# EAGLE design display (EAGLE 5.10)
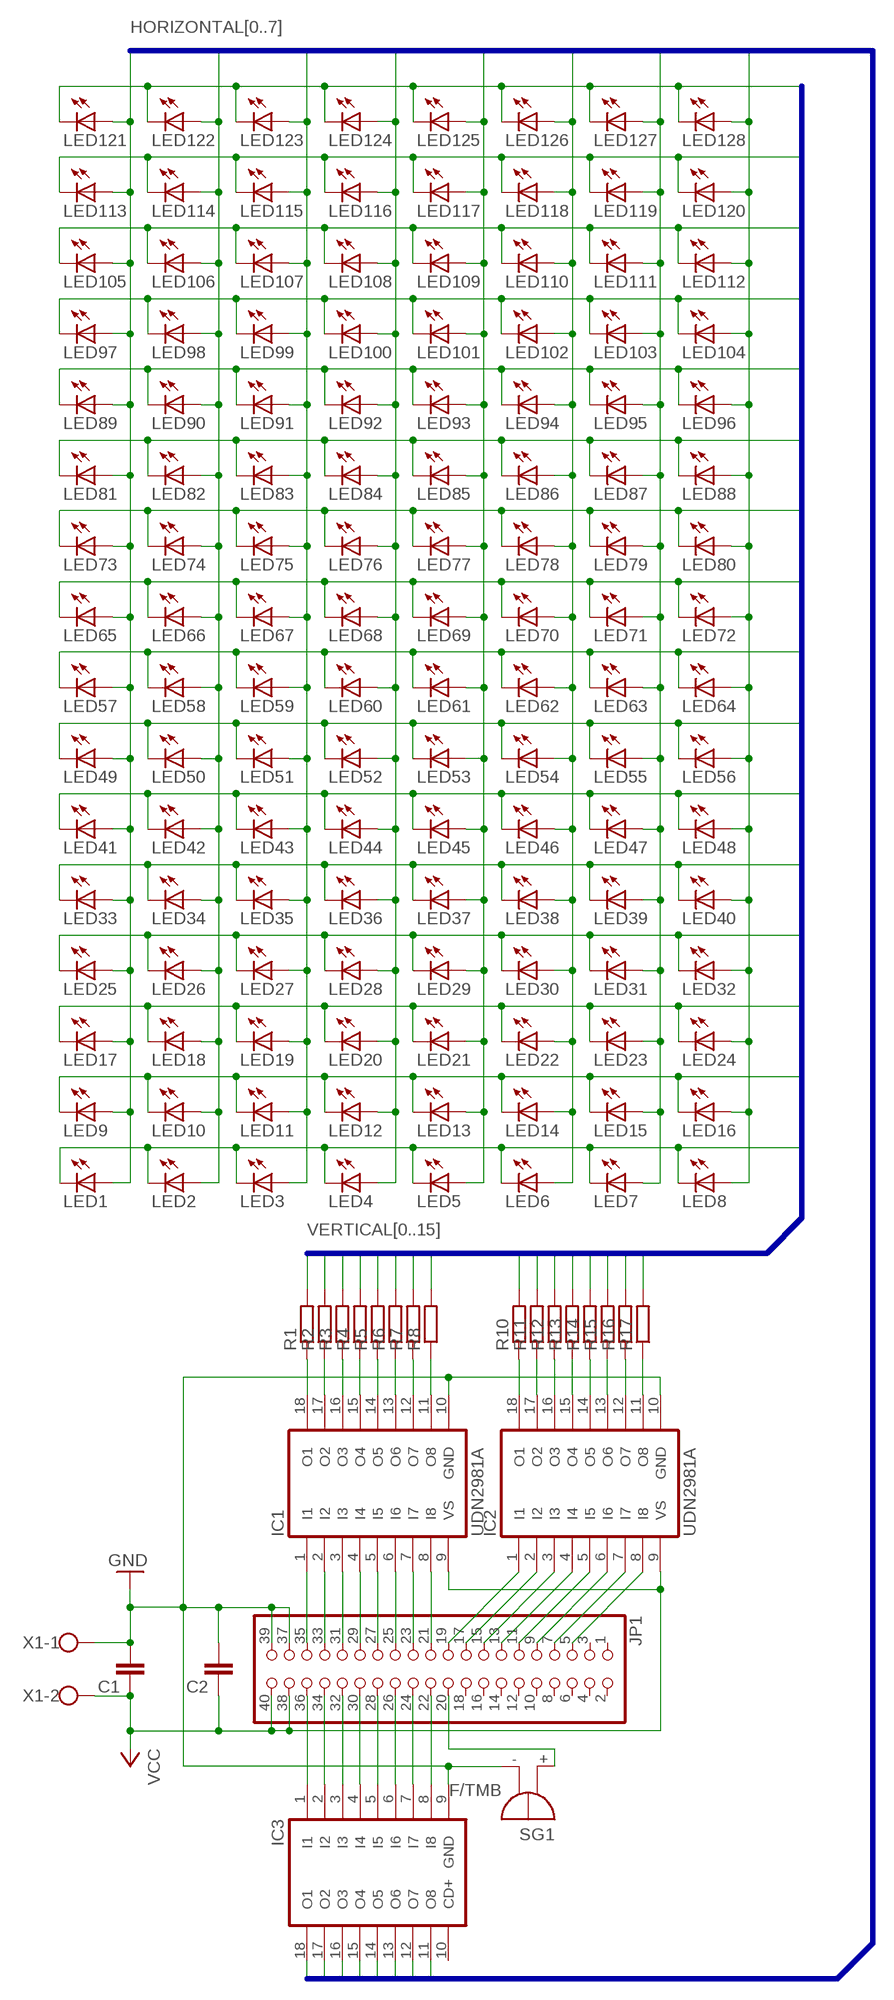
[diagram p0: schematic, sheet 1]

## Parts
C1  C-EU025-030X050  [C025-030X050]
C2  C-EU025-030X050  [C025-030X050]
IC1  UDN2981A  [DIL18]
IC2  UDN2981A  [DIL18]
IC3  ULN2803A  [DIL18]
JP1  PINHD-2X20  [2X20]
LED1  LED5MM  [LED5MM]
LED2  LED5MM  [LED5MM]
LED3  LED5MM  [LED5MM]
LED4  LED5MM  [LED5MM]
LED5  LED5MM  [LED5MM]
LED6  LED5MM  [LED5MM]
LED7  LED5MM  [LED5MM]
LED8  LED5MM  [LED5MM]
LED9  LED5MM  [LED5MM]
LED10  LED5MM  [LED5MM]
LED11  LED5MM  [LED5MM]
LED12  LED5MM  [LED5MM]
LED13  LED5MM  [LED5MM]
LED14  LED5MM  [LED5MM]
LED15  LED5MM  [LED5MM]
LED16  LED5MM  [LED5MM]
LED17  LED5MM  [LED5MM]
LED18  LED5MM  [LED5MM]
LED19  LED5MM  [LED5MM]
LED20  LED5MM  [LED5MM]
LED21  LED5MM  [LED5MM]
LED22  LED5MM  [LED5MM]
LED23  LED5MM  [LED5MM]
LED24  LED5MM  [LED5MM]
LED25  LED5MM  [LED5MM]
LED26  LED5MM  [LED5MM]
LED27  LED5MM  [LED5MM]
LED28  LED5MM  [LED5MM]
LED29  LED5MM  [LED5MM]
LED30  LED5MM  [LED5MM]
LED31  LED5MM  [LED5MM]
LED32  LED5MM  [LED5MM]
LED33  LED5MM  [LED5MM]
LED34  LED5MM  [LED5MM]
LED35  LED5MM  [LED5MM]
LED36  LED5MM  [LED5MM]
LED37  LED5MM  [LED5MM]
LED38  LED5MM  [LED5MM]
LED39  LED5MM  [LED5MM]
LED40  LED5MM  [LED5MM]
LED41  LED5MM  [LED5MM]
LED42  LED5MM  [LED5MM]
LED43  LED5MM  [LED5MM]
LED44  LED5MM  [LED5MM]
LED45  LED5MM  [LED5MM]
LED46  LED5MM  [LED5MM]
LED47  LED5MM  [LED5MM]
LED48  LED5MM  [LED5MM]
LED49  LED5MM  [LED5MM]
LED50  LED5MM  [LED5MM]
LED51  LED5MM  [LED5MM]
LED52  LED5MM  [LED5MM]
LED53  LED5MM  [LED5MM]
LED54  LED5MM  [LED5MM]
LED55  LED5MM  [LED5MM]
LED56  LED5MM  [LED5MM]
LED57  LED5MM  [LED5MM]
LED58  LED5MM  [LED5MM]
LED59  LED5MM  [LED5MM]
LED60  LED5MM  [LED5MM]
LED61  LED5MM  [LED5MM]
LED62  LED5MM  [LED5MM]
LED63  LED5MM  [LED5MM]
LED64  LED5MM  [LED5MM]
LED65  LED5MM  [LED5MM]
LED66  LED5MM  [LED5MM]
LED67  LED5MM  [LED5MM]
LED68  LED5MM  [LED5MM]
LED69  LED5MM  [LED5MM]
LED70  LED5MM  [LED5MM]
LED71  LED5MM  [LED5MM]
LED72  LED5MM  [LED5MM]
LED73  LED5MM  [LED5MM]
LED74  LED5MM  [LED5MM]
LED75  LED5MM  [LED5MM]
LED76  LED5MM  [LED5MM]
LED77  LED5MM  [LED5MM]
LED78  LED5MM  [LED5MM]
LED79  LED5MM  [LED5MM]
LED80  LED5MM  [LED5MM]
LED81  LED5MM  [LED5MM]
LED82  LED5MM  [LED5MM]
LED83  LED5MM  [LED5MM]
LED84  LED5MM  [LED5MM]
LED85  LED5MM  [LED5MM]
LED86  LED5MM  [LED5MM]
LED87  LED5MM  [LED5MM]
LED88  LED5MM  [LED5MM]
LED89  LED5MM  [LED5MM]
LED90  LED5MM  [LED5MM]
LED91  LED5MM  [LED5MM]
LED92  LED5MM  [LED5MM]
LED93  LED5MM  [LED5MM]
LED94  LED5MM  [LED5MM]
LED95  LED5MM  [LED5MM]
LED96  LED5MM  [LED5MM]
LED97  LED5MM  [LED5MM]
LED98  LED5MM  [LED5MM]
LED99  LED5MM  [LED5MM]
LED100  LED5MM  [LED5MM]
LED101  LED5MM  [LED5MM]
LED102  LED5MM  [LED5MM]
LED103  LED5MM  [LED5MM]
LED104  LED5MM  [LED5MM]
LED105  LED5MM  [LED5MM]
LED106  LED5MM  [LED5MM]
LED107  LED5MM  [LED5MM]
LED108  LED5MM  [LED5MM]
LED109  LED5MM  [LED5MM]
LED110  LED5MM  [LED5MM]
LED111  LED5MM  [LED5MM]
LED112  LED5MM  [LED5MM]
LED113  LED5MM  [LED5MM]
LED114  LED5MM  [LED5MM]
LED115  LED5MM  [LED5MM]
LED116  LED5MM  [LED5MM]
LED117  LED5MM  [LED5MM]
LED118  LED5MM  [LED5MM]
LED119  LED5MM  [LED5MM]
LED120  LED5MM  [LED5MM]
LED121  LED5MM  [LED5MM]
LED122  LED5MM  [LED5MM]
LED123  LED5MM  [LED5MM]
LED124  LED5MM  [LED5MM]
LED125  LED5MM  [LED5MM]
LED126  LED5MM  [LED5MM]
LED127  LED5MM  [LED5MM]
LED128  LED5MM  [LED5MM]
R1  R-EU_0204/2V  [0204V]
R2  R-EU_0204/2V  [0204V]
R3  R-EU_0204/2V  [0204V]
R4  R-EU_0204/2V  [0204V]
R5  R-EU_0204/2V  [0204V]
R6  R-EU_0204/2V  [0204V]
R7  R-EU_0204/2V  [0204V]
R8  R-EU_0204/2V  [0204V]
R10  R-EU_0204/2V  [0204V]
R11  R-EU_0204/2V  [0204V]
R12  R-EU_0204/2V  [0204V]
R13  R-EU_0204/2V  [0204V]
R14  R-EU_0204/2V  [0204V]
R15  R-EU_0204/2V  [0204V]
R16  R-EU_0204/2V  [0204V]
R17  R-EU_0204/2V  [0204V]
SG1  F/TMB  [F/TMB]
X1  W237-102  [W237-102]

## Nets
GND: C1.2 C2.2 IC1.10(GND) IC2.10(GND) IC3.9(GND) JP1.37 JP1.39 SG1.- X1.1
HORIZONTAL0: LED1.K(C) LED2.K(C) LED3.K(C) LED4.K(C) LED5.K(C) LED6.K(C) LED7.K(C) LED8.K(C) R17.2
HORIZONTAL1: LED9.K(C) LED10.K(C) LED11.K(C) LED12.K(C) LED13.K(C) LED14.K(C) LED15.K(C) LED16.K(C) R16.2
HORIZONTAL2: LED17.K(C) LED18.K(C) LED19.K(C) LED20.K(C) LED21.K(C) LED22.K(C) LED23.K(C) LED24.K(C) R15.2
HORIZONTAL3: LED25.K(C) LED26.K(C) LED27.K(C) LED28.K(C) LED29.K(C) LED30.K(C) LED31.K(C) LED32.K(C) R14.2
HORIZONTAL4: LED33.K(C) LED34.K(C) LED35.K(C) LED36.K(C) LED37.K(C) LED38.K(C) LED39.K(C) LED40.K(C) R13.2
HORIZONTAL5: LED41.K(C) LED42.K(C) LED43.K(C) LED44.K(C) LED45.K(C) LED46.K(C) LED47.K(C) LED48.K(C) R12.2
HORIZONTAL6: LED49.K(C) LED50.K(C) LED51.K(C) LED52.K(C) LED53.K(C) LED54.K(C) LED55.K(C) LED56.K(C) R11.2
HORIZONTAL7: LED57.K(C) LED58.K(C) LED59.K(C) LED60.K(C) LED61.K(C) LED62.K(C) LED63.K(C) LED64.K(C) R10.2
HORIZONTAL8: LED65.K(C) LED66.K(C) LED67.K(C) LED68.K(C) LED69.K(C) LED70.K(C) LED71.K(C) LED72.K(C) R8.2
HORIZONTAL9: LED73.K(C) LED74.K(C) LED75.K(C) LED76.K(C) LED77.K(C) LED78.K(C) LED79.K(C) LED80.K(C) R7.2
HORIZONTAL10: LED81.K(C) LED82.K(C) LED83.K(C) LED84.K(C) LED85.K(C) LED86.K(C) LED87.K(C) LED88.K(C) R6.2
HORIZONTAL11: LED89.K(C) LED90.K(C) LED91.K(C) LED92.K(C) LED93.K(C) LED94.K(C) LED95.K(C) LED96.K(C) R5.2
HORIZONTAL12: LED97.K(C) LED98.K(C) LED99.K(C) LED100.K(C) LED101.K(C) LED102.K(C) LED103.K(C) LED104.K(C) R4.2
HORIZONTAL13: LED105.K(C) LED106.K(C) LED107.K(C) LED108.K(C) LED109.K(C) LED110.K(C) LED111.K(C) LED112.K(C) R3.2
HORIZONTAL14: LED113.K(C) LED114.K(C) LED115.K(C) LED116.K(C) LED117.K(C) LED118.K(C) LED119.K(C) LED120.K(C) R2.2
HORIZONTAL15: LED121.K(C) LED122.K(C) LED123.K(C) LED124.K(C) LED125.K(C) LED126.K(C) LED127.K(C) LED128.K(C) R1.2
N$1: IC1.1(I1) JP1.35
N$2: IC1.2(I2) JP1.33
N$3: IC1.3(I3) JP1.31
N$4: IC1.4(I4) JP1.29
N$5: IC1.5(I5) JP1.27
N$6: IC1.6(I6) JP1.25
N$7: IC1.7(I7) JP1.23
N$8: IC1.8(I8) JP1.21
N$9: IC2.1(I1) JP1.19
N$10: IC2.2(I2) JP1.17
N$11: IC2.3(I3) JP1.15
N$12: IC2.4(I4) JP1.13
N$13: IC2.5(I5) JP1.11
N$14: IC2.6(I6) JP1.9
N$15: IC2.7(I7) JP1.7
N$16: IC2.8(I8) JP1.5
N$17: IC3.1(I1) JP1.36
N$18: IC3.2(I2) JP1.34
N$19: IC3.3(I3) JP1.32
N$20: IC3.4(I4) JP1.30
N$21: IC3.5(I5) JP1.28
N$22: IC3.6(I6) JP1.26
N$23: IC3.7(I7) JP1.24
N$24: IC3.8(I8) JP1.22
N$25: IC2.11(O8) R17.1
N$26: IC2.12(O7) R16.1
N$27: IC2.13(O6) R15.1
N$28: IC2.14(O5) R14.1
N$29: IC2.15(O4) R13.1
N$30: IC2.16(O3) R12.1
N$31: IC2.17(O2) R11.1
N$32: IC2.18(O1) R10.1
N$33: IC1.11(O8) R8.1
N$34: IC1.12(O7) R7.1
N$35: IC1.13(O6) R6.1
N$36: IC1.14(O5) R5.1
N$37: IC1.15(O4) R4.1
N$38: IC1.16(O3) R3.1
N$39: IC1.17(O2) R2.1
N$40: IC1.18(O1) R1.1
N$41: JP1.20 SG1.+
VCC: C1.1 C2.1 IC1.9(VS) IC2.9(VS) JP1.38 JP1.40 X1.2
VERTICAL0: IC3.18(O1) LED1.A LED9.A LED17.A LED25.A LED33.A LED41.A LED49.A LED57.A LED65.A LED73.A LED81.A LED89.A LED97.A LED105.A LED113.A LED121.A
VERTICAL1: IC3.17(O2) LED2.A LED10.A LED18.A LED26.A LED34.A LED42.A LED50.A LED58.A LED66.A LED74.A LED82.A LED90.A LED98.A LED106.A LED114.A LED122.A
VERTICAL2: IC3.16(O3) LED3.A LED11.A LED19.A LED27.A LED35.A LED43.A LED51.A LED59.A LED67.A LED75.A LED83.A LED91.A LED99.A LED107.A LED115.A LED123.A
VERTICAL3: IC3.15(O4) LED4.A LED12.A LED20.A LED28.A LED36.A LED44.A LED52.A LED60.A LED68.A LED76.A LED84.A LED92.A LED100.A LED108.A LED116.A LED124.A
VERTICAL4: IC3.14(O5) LED5.A LED13.A LED21.A LED29.A LED37.A LED45.A LED53.A LED61.A LED69.A LED77.A LED85.A LED93.A LED101.A LED109.A LED117.A LED125.A
VERTICAL5: IC3.13(O6) LED6.A LED14.A LED22.A LED30.A LED38.A LED46.A LED54.A LED62.A LED70.A LED78.A LED86.A LED94.A LED102.A LED110.A LED118.A LED126.A
VERTICAL6: IC3.12(O7) LED7.A LED15.A LED23.A LED31.A LED39.A LED47.A LED55.A LED63.A LED71.A LED79.A LED87.A LED95.A LED103.A LED111.A LED119.A LED127.A
VERTICAL7: IC3.11(O8) LED8.A LED16.A LED24.A LED32.A LED40.A LED48.A LED56.A LED64.A LED72.A LED80.A LED88.A LED96.A LED104.A LED112.A LED120.A LED128.A
Unconnected: IC3.10(CD+) JP1.1 JP1.2 JP1.3 JP1.4 JP1.6 JP1.8 JP1.10 JP1.12 JP1.14 JP1.16 JP1.18

## Buses
HORIZONTAL[0..7]
VERTICAL[0..15]

## Library data of the parts
C1 C2 = rcl:C-EU: CAPACITOR, European symbol
IC1 IC2 = uln-udn:UDN298*: DRIVER ARRAY Source: Allegro Microsystems Inc. / UDN2981-UDN2984.pdf
IC3 = uln-udn:ULN2803A: DRIVER ARRAY
JP1 = pinhead:PINHD-2X20: PIN HEADER
LED1-LED128 = led:LED: LED OSRAM: - CHIPLED LG R971, LG N971, LY N971, LG Q971, LY Q971, LO R971, LY R971 LH N974, LH R974 LS Q976, LO Q976, LY Q976 LO Q996 - Hyper CHIPLED LW Q18S LB Q993, LB Q99A, LB R99A - SideLED LS A670, LO A670, LY A670, LG A670, LP A670 LB A673, LV A673, LT A673, LW A673 LH A674 LY A675 LS A676, LA A676, LO A676, LY A676, LW A676 LS A679, LY A679, LG A679 - Hyper Micro SIDELED® LS Y876, LA Y876, LO Y876, LY Y876 LT Y87S - SmartLED LW L88C, LW L88S LB L89C, LB L89S, LG L890 LS L89K, LO L89K, LY L89K LS L896, LA L896, LO L896, LY L896 - TOPLED LS T670, LO T670, LY T670, LG T670, LP T670 LSG T670, LSP T670, LSY T670, LOP T670, LYG T670 LG T671, LOG T671, LSG T671 LB T673, LV T673, LT T673, LW T673 LH T674 LS T676, LA T676, LO T676, LY T676, LB T676, LH T676, LSB T676, LW T676 LB T67C, LV T67C, LT T67C, LS T67K, LO T67K, LY T67K, LW E67C LS E67B, LA E67B, LO E67B, LY E67B, LB E67C, LV E67C, LT E67C LW T67C LS T679, LY T679, LG T679 LS T770, LO T770, LY T770, LG T770, LP T770 LB T773, LV T773, LT T773, LW T773 LH T774 LS E675, LA E675, LY E675, LS T675 LS T776, LA T776, LO T776, LY T776, LB T776 LHGB T686 LT T68C, LB T68C - Hyper Mini TOPLED® LB M676 - Mini TOPLED Santana® LG M470 LS M47K, LO M47K, LY M47K Source: http://www.osram.convergy.de LUXEON: - LUMILED® LXK2-PW12-R00, LXK2-PW12-S00, LXK2-PW14-U00, LXK2-PW14-V00 LXK2-PM12-R00, LXK2-PM12-S00, LXK2-PM14-U00 LXK2-PE12-Q00, LXK2-PE12-R00, LXK2-PE12-S00, LXK2-PE14-T00, LXK2-PE14-U00 LXK2-PB12-K00, LXK2-PB12-L00, LXK2-PB12-M00, LXK2-PB14-N00, LXK2-PB14-P00, LXK2-PB14-Q00 LXK2-PR12-L00, LXK2-PR12-M00, LXK2-PR14-Q00, LXK2-PR14-R00 LXK2-PD12-Q00, LXK2-PD12-R00, LXK2-PD12-S00 LXK2-PH12-R00, LXK2-PH12-S00 LXK2-PL12-P00, LXK2-PL12-Q00, LXK2-PL12-R00 Source: www.luxeon.com KINGBRIGHT: KA-3528ASYC Source: www.kingbright.com
R1-R8 R10-R17 = rcl:R-EU_: RESISTOR, European symbol
SG1 = buzzer:F/TMB: BUZZER Source: Buerklin
X1 = con-wago-500:W237-102: WAGO SCREW CLAMP

## Board
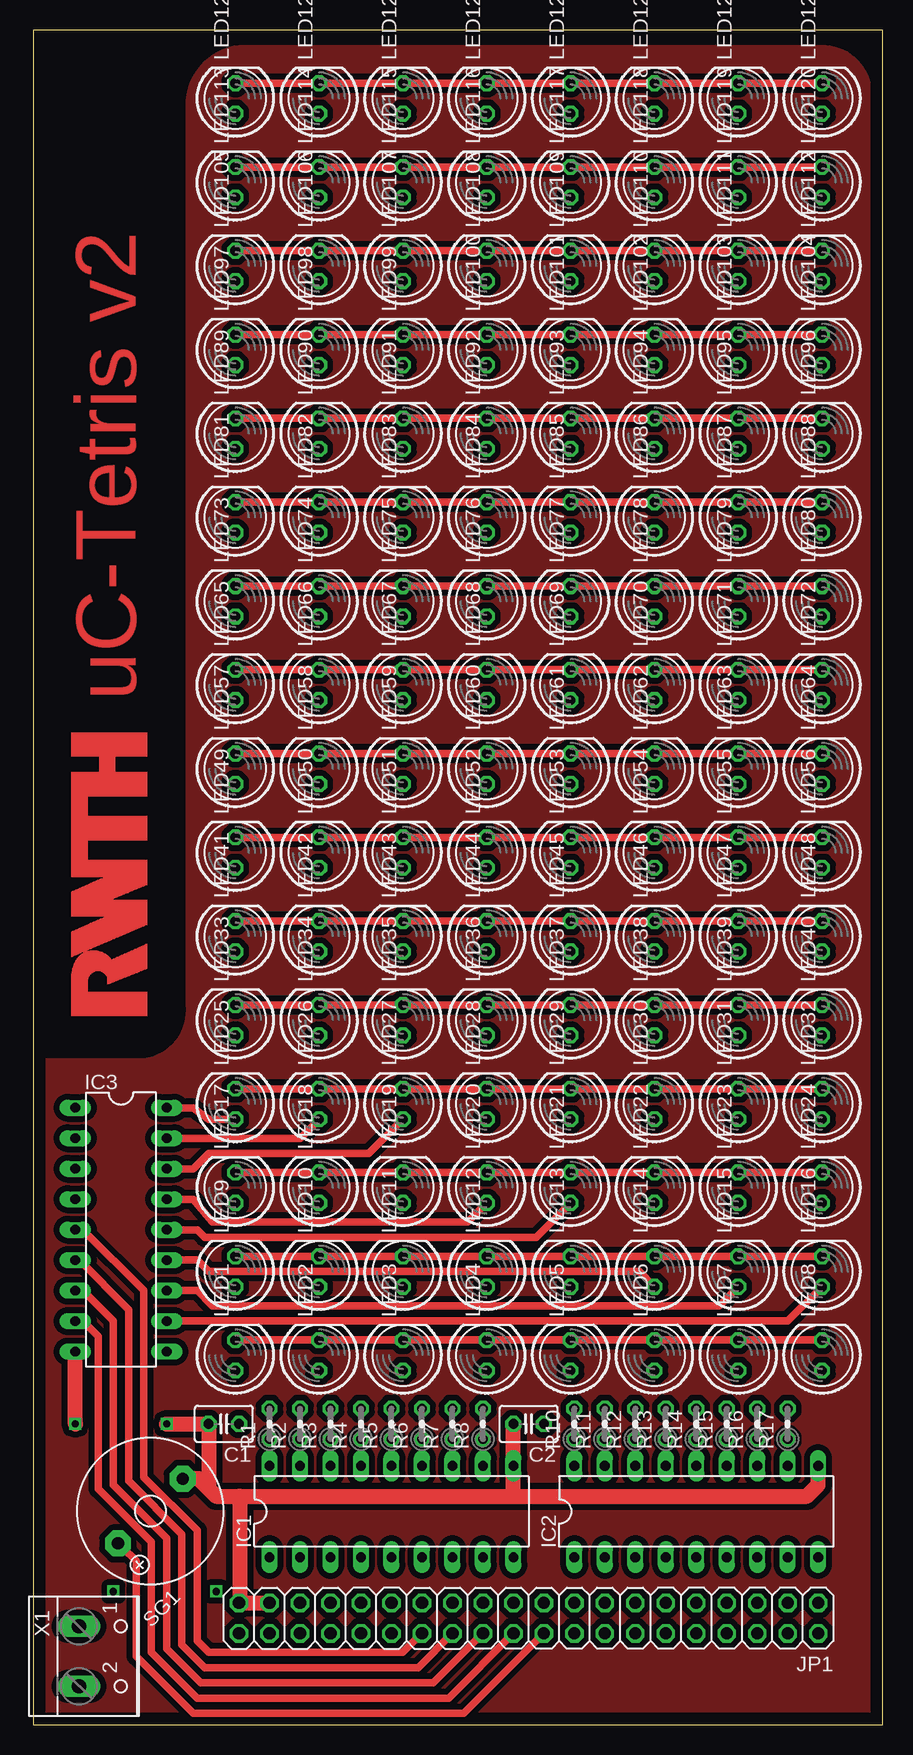
[diagram p1: board, top side]
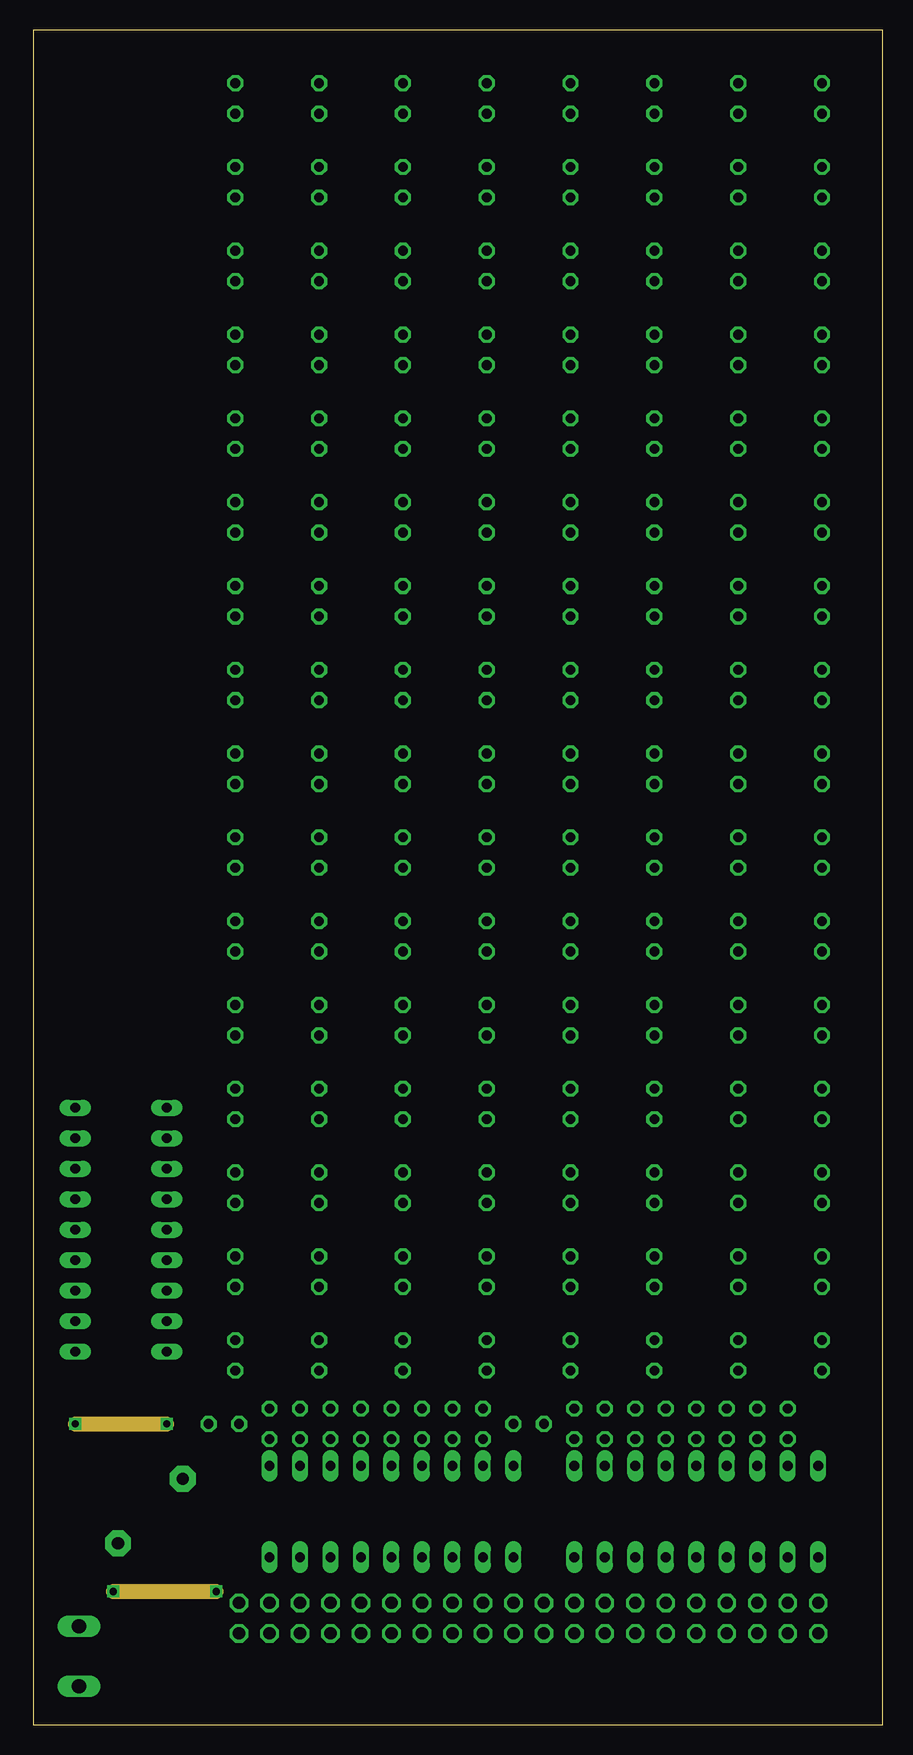
[diagram p2: board, inner layer Wires]
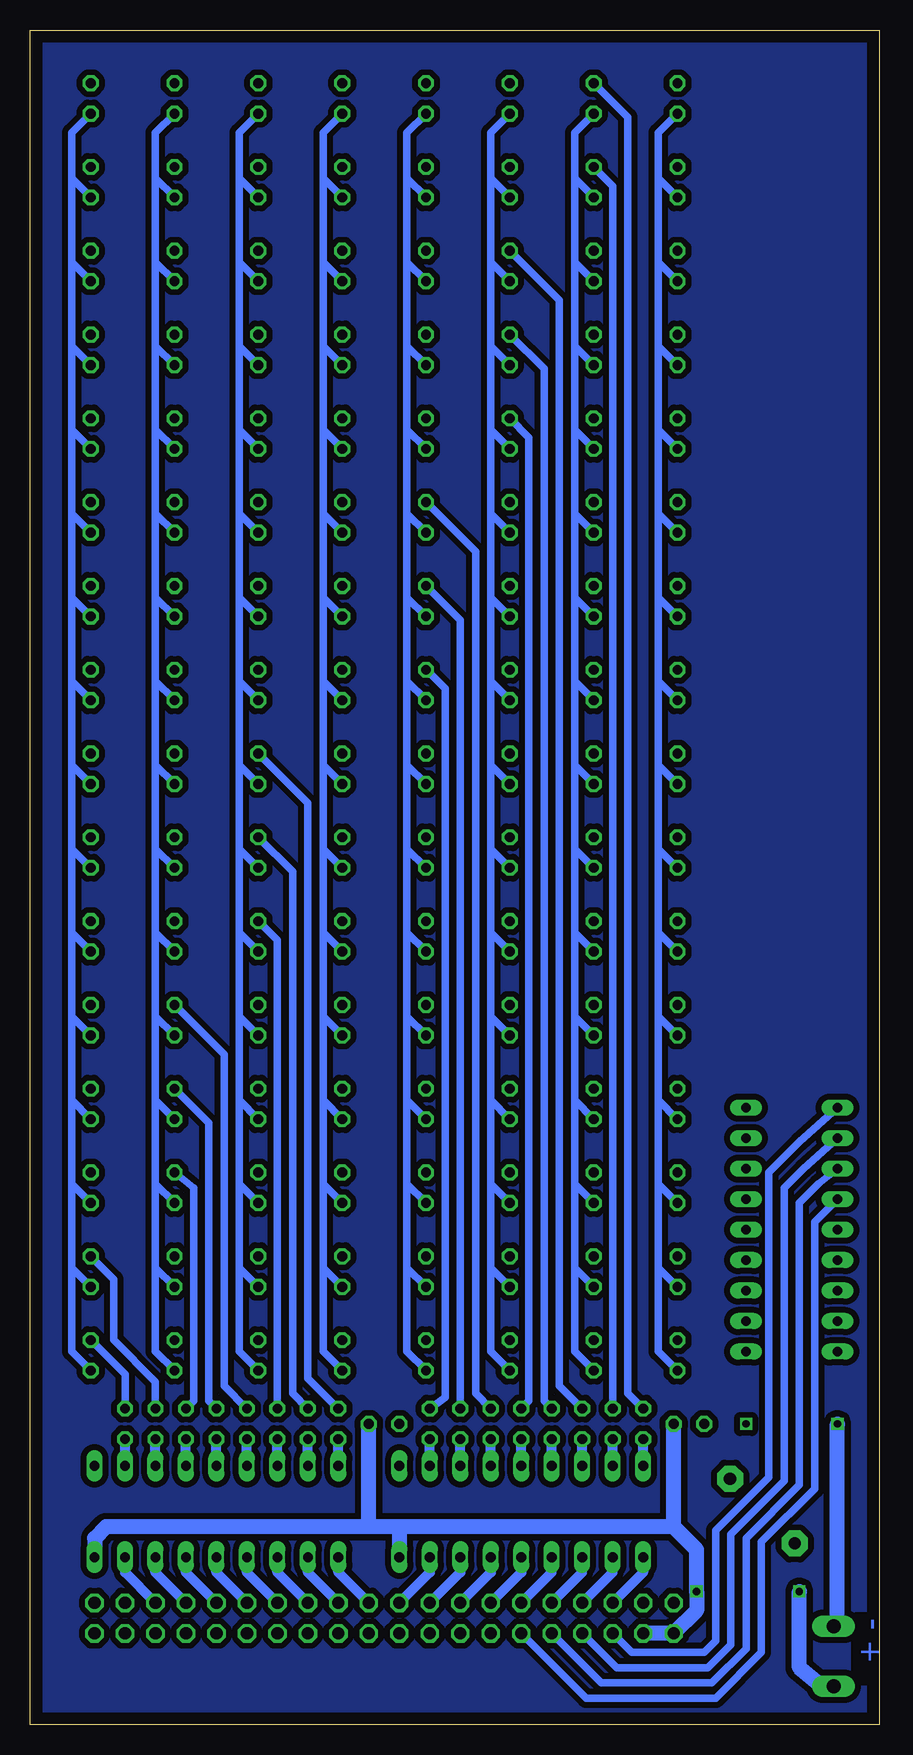
[diagram p3: board, bottom side, seen from below]

Size 70.78 x 141.28 mm. Coordinates in mm from the lower left corner, seen from the top.
Outline: 0,0 70.78,0 70.78,141.28 0,141.28 0,0
Copper layers (1*2*16): Top 0.035mm / dielectric 1.5mm / Wires 0.035mm / dielectric 0.15mm / Bottom 0.035mm
Design rules "default *": minimum track width 10mil, minimum drill 24mil, track to track 20mil, track to pad 20mil, pad to pad 8mil, via to via 8mil, smd to smd 8mil, copper to edge 40mil, drill to drill 8mil, minimum pad ring 10mil, minimum via ring 8mil, stop-mask expansion 4mil, vias tented up to drill 0mil, thermal gap 10mil

### Footprints (pad centres in the part's own frame; a part is rotated, then mirrored left to right if it is on the bottom)
C025-030X050 = drill 0.813 octagon: 1 -1.27,0; 2 1.27,0
DIL18 = drill 0.813 long: 1 -10.16,-3.81; 2 -7.62,-3.81; 3 -5.08,-3.81; 4 -2.54,-3.81; 5 0,-3.81; 6 2.54,-3.81; 7 5.08,-3.81; 8 7.62,-3.81; 9 10.16,-3.81; 10 10.16,3.81; 11 7.62,3.81; 12 5.08,3.81; 13 2.54,3.81; 14 0,3.81; 15 -2.54,3.81; 16 -5.08,3.81; 17 -7.62,3.81; 18 -10.16,3.81
2X20 = drill 1.016 octagon: 1 -24.13,-1.27; 2 -24.13,1.27; 3 -21.59,-1.27; 4 -21.59,1.27; 5 -19.05,-1.27; 6 -19.05,1.27; 7 -16.51,-1.27; 8 -16.51,1.27; 9 -13.97,-1.27; 10 -13.97,1.27; 11 -11.43,-1.27; 12 -11.43,1.27; 13 -8.89,-1.27; 14 -8.89,1.27; 15 -6.35,-1.27; 16 -6.35,1.27; 17 -3.81,-1.27; 18 -3.81,1.27; 19 -1.27,-1.27; 20 -1.27,1.27; 21 1.27,-1.27; 22 1.27,1.27; 23 3.81,-1.27; 24 3.81,1.27; 25 6.35,-1.27; 26 6.35,1.27; 27 8.89,-1.27; 28 8.89,1.27; 29 11.43,-1.27; 30 11.43,1.27; 31 13.97,-1.27; 32 13.97,1.27; 33 16.51,-1.27; 34 16.51,1.27; 35 19.05,-1.27; 36 19.05,1.27; 37 21.59,-1.27; 38 21.59,1.27; 39 24.13,-1.27; 40 24.13,1.27
LED5MM = drill 0.813 octagon: A -1.27,0; K 1.27,0
0204V = drill 0.813 octagon: 1 -1.27,0; 2 1.27,0
F/TMB = drill 1.016 pad 2.159 octagon: + 3.81,0; - -3.81,0
W237-102 = drill 1.194 long: 1 -2.5,-1.27; 2 2.5,-1.27

### Placement (x,y rotation side)
C1  15.88,25.08 180 top
C2  41.27,25.08 180 top
IC1  29.84,17.78 0 top
IC2  55.24,17.78 0 top
IC3  7.3,41.27 270 top
JP1  41.27,8.89 180 top
LED1  16.83,30.8 90 top
LED2  23.81,30.8 90 top
LED3  30.8,30.8 90 top
LED4  37.78,30.8 90 top
LED5  44.77,30.8 90 top
LED6  51.75,30.8 90 top
LED7  58.74,30.8 90 top
LED8  65.72,30.8 90 top
LED9  16.83,37.78 90 top
LED10  23.81,37.78 90 top
LED11  30.8,37.78 90 top
LED12  37.78,37.78 90 top
LED13  44.77,37.78 90 top
LED14  51.75,37.78 90 top
LED15  58.74,37.78 90 top
LED16  65.72,37.78 90 top
LED17  16.83,44.77 90 top
LED18  23.81,44.77 90 top
LED19  30.8,44.77 90 top
LED20  37.78,44.77 90 top
LED21  44.77,44.77 90 top
LED22  51.75,44.77 90 top
LED23  58.74,44.77 90 top
LED24  65.72,44.77 90 top
LED25  16.83,51.75 90 top
LED26  23.81,51.75 90 top
LED27  30.8,51.75 90 top
LED28  37.78,51.75 90 top
LED29  44.77,51.75 90 top
LED30  51.75,51.75 90 top
LED31  58.74,51.75 90 top
LED32  65.72,51.75 90 top
LED33  16.83,58.74 90 top
LED34  23.81,58.74 90 top
LED35  30.8,58.74 90 top
LED36  37.78,58.74 90 top
LED37  44.77,58.74 90 top
LED38  51.75,58.74 90 top
LED39  58.74,58.74 90 top
LED40  65.72,58.74 90 top
LED41  16.83,65.72 90 top
LED42  23.81,65.72 90 top
LED43  30.8,65.72 90 top
LED44  37.78,65.72 90 top
LED45  44.77,65.72 90 top
LED46  51.75,65.72 90 top
LED47  58.74,65.72 90 top
LED48  65.72,65.72 90 top
LED49  16.83,72.71 90 top
LED50  23.81,72.71 90 top
LED51  30.8,72.71 90 top
LED52  37.78,72.71 90 top
LED53  44.77,72.71 90 top
LED54  51.75,72.71 90 top
LED55  58.74,72.71 90 top
LED56  65.72,72.71 90 top
LED57  16.83,79.69 90 top
LED58  23.81,79.69 90 top
LED59  30.8,79.69 90 top
LED60  37.78,79.69 90 top
LED61  44.77,79.69 90 top
LED62  51.75,79.69 90 top
LED63  58.74,79.69 90 top
LED64  65.72,79.69 90 top
LED65  16.83,86.68 90 top
LED66  23.81,86.68 90 top
LED67  30.8,86.68 90 top
LED68  37.78,86.68 90 top
LED69  44.77,86.68 90 top
LED70  51.75,86.68 90 top
LED71  58.74,86.68 90 top
LED72  65.72,86.68 90 top
LED73  16.83,93.66 90 top
LED74  23.81,93.66 90 top
LED75  30.8,93.66 90 top
LED76  37.78,93.66 90 top
LED77  44.77,93.66 90 top
LED78  51.75,93.66 90 top
LED79  58.74,93.66 90 top
LED80  65.72,93.66 90 top
LED81  16.83,100.65 90 top
LED82  23.81,100.65 90 top
LED83  30.8,100.65 90 top
LED84  37.78,100.65 90 top
LED85  44.77,100.65 90 top
LED86  51.75,100.65 90 top
LED87  58.74,100.65 90 top
LED88  65.72,100.65 90 top
LED89  16.83,107.63 90 top
LED90  23.81,107.63 90 top
LED91  30.8,107.63 90 top
LED92  37.78,107.63 90 top
LED93  44.77,107.63 90 top
LED94  51.75,107.63 90 top
LED95  58.74,107.63 90 top
LED96  65.72,107.63 90 top
LED97  16.83,114.62 90 top
LED98  23.81,114.62 90 top
LED99  30.8,114.62 90 top
LED100  37.78,114.62 90 top
LED101  44.77,114.62 90 top
LED102  51.75,114.62 90 top
LED103  58.74,114.62 90 top
LED104  65.72,114.62 90 top
LED105  16.83,121.6 90 top
LED106  23.81,121.6 90 top
LED107  30.8,121.6 90 top
LED108  37.78,121.6 90 top
LED109  44.77,121.6 90 top
LED110  51.75,121.6 90 top
LED111  58.74,121.6 90 top
LED112  65.72,121.6 90 top
LED113  16.83,128.59 90 top
LED114  23.81,128.59 90 top
LED115  30.8,128.59 90 top
LED116  37.78,128.59 90 top
LED117  44.77,128.59 90 top
LED118  51.75,128.59 90 top
LED119  58.74,128.59 90 top
LED120  65.72,128.59 90 top
LED121  16.83,135.57 90 top
LED122  23.81,135.57 90 top
LED123  30.8,135.57 90 top
LED124  37.78,135.57 90 top
LED125  44.77,135.57 90 top
LED126  51.75,135.57 90 top
LED127  58.74,135.57 90 top
LED128  65.72,135.57 90 top
R1  19.69,25.08 90 top
R2  22.23,25.08 90 top
R3  24.77,25.08 90 top
R4  27.31,25.08 90 top
R5  29.84,25.08 90 top
R6  32.39,25.08 90 top
R7  34.92,25.08 90 top
R8  37.46,25.08 90 top
R10  45.08,25.08 90 top
R11  47.63,25.08 90 top
R12  50.17,25.08 90 top
R13  52.7,25.08 90 top
R14  55.24,25.08 90 top
R15  57.79,25.08 90 top
R16  60.33,25.08 90 top
R17  62.86,25.08 90 top
SG1  9.75,17.82 225 top
X1  5.08,5.71 270 top

### Tracks (layer width: path | path; a pad name or v marks a point on that pad's centre or on a via)
GND  (via drill 0.6)
  Top 1.27: JP1.37 JP1.39 17.18,10.13 17.18,19.05 | IC2.10 65.41,20 64.45,19.05 40.01,19.05 | 40.01,19.05 IC1.10 C2.2 | v3.49,25.08 IC3.9 | 17.18,19.05 40.01,19.05 | v11.11,25.08 C1.2 14.61,19.69 | 17.18,19.05 15.24,19.05 14.61,19.69 | SG1.- 13.78,20.51 14.61,19.69
  Wires 1.27: v3.49,25.08 v11.11,25.08
  Bottom 1.27: v3.49,25.08 3.49,8.53 X1.1
HORIZONTAL0
  Top 0.61: LED1.K LED2.K LED3.K LED4.K LED5.K LED6.K LED7.K LED8.K
  Bottom 0.61: R17.2 62.86,29.21 LED8.K
HORIZONTAL1
  Top 0.61: LED9.K LED10.K LED11.K LED12.K LED13.K LED14.K LED15.K LED16.K
  Bottom 0.61: R16.2 60.33,28.57 63.82,32.07 63.82,37.15 LED16.K
HORIZONTAL2
  Top 0.61: LED24.K LED23.K LED22.K LED21.K LED20.K LED19.K LED18.K LED17.K
  Bottom 0.61: R15.2 57.15,26.99 57.15,44.77 LED23.K
HORIZONTAL3
  Top 0.61: LED25.K LED26.K LED27.K LED28.K LED29.K LED30.K LED31.K LED32.K
  Bottom 0.61: R14.2 55.88,26.99 55.88,50.17 LED31.K
HORIZONTAL4
  Top 0.61: LED33.K LED34.K LED35.K LED36.K LED37.K LED38.K LED39.K LED40.K
  Bottom 0.61: R13.2 54.61,28.26 54.61,55.88 LED39.K
HORIZONTAL5
  Top 0.61: LED48.K LED47.K LED46.K LED45.K LED44.K LED43.K LED42.K LED41.K
  Bottom 0.61: R12.2 50.17,65.4 LED46.K
HORIZONTAL6
  Top 0.61: LED49.K LED50.K LED51.K LED52.K LED53.K LED54.K LED55.K LED56.K
  Bottom 0.61: R11.2 48.89,27.62 48.89,71.12 LED54.K
HORIZONTAL7
  Top 0.61: LED64.K LED63.K LED62.K LED61.K LED60.K LED59.K LED58.K LED57.K
  Bottom 0.61: R10.2 47.63,28.89 47.63,76.84 LED62.K
HORIZONTAL8
  Top 0.61: LED65.K LED66.K LED67.K LED68.K LED69.K LED70.K LED71.K LED72.K
  Bottom 0.61: R8.2 36.2,27.3 36.2,86.36 LED68.K
HORIZONTAL9
  Top 0.61: LED73.K LED74.K LED75.K LED76.K LED77.K LED78.K LED79.K LED80.K
  Bottom 0.61: R7.2 34.92,92.07 LED76.K
HORIZONTAL10
  Top 0.61: LED81.K LED82.K LED83.K LED84.K LED85.K LED86.K LED87.K LED88.K
  Bottom 0.61: R6.2 33.65,27.62 33.65,97.79 LED84.K
HORIZONTAL11
  Top 0.61: LED96.K LED95.K LED94.K LED93.K LED92.K LED91.K LED90.K LED89.K
  Bottom 0.61: R5.2 29.21,26.99 29.21,107.31 LED91.K
HORIZONTAL12
  Top 0.61: LED97.K LED98.K LED99.K LED100.K LED101.K LED102.K LED103.K LED104.K
  Bottom 0.61: R4.2 27.94,26.99 27.94,113.03 LED99.K
HORIZONTAL13
  Top 0.61: LED112.K LED111.K LED110.K LED109.K LED108.K LED107.K LED106.K LED105.K
  Bottom 0.61: R3.2 26.67,28.26 26.67,118.74 LED107.K
HORIZONTAL14
  Top 0.61: LED113.K LED114.K LED115.K LED116.K LED117.K LED118.K LED119.K LED120.K
  Bottom 0.61: R2.2 22.23,128.27 LED114.K
HORIZONTAL15
  Top 0.61: LED121.K LED122.K LED123.K LED124.K LED125.K LED126.K LED127.K LED128.K
  Bottom 0.61: R1.2 20.95,27.62 20.95,133.99 LED122.K
N$1
  Bottom 0.813: IC1.1 19.69,12.7 JP1.35
N$2
  Bottom 0.813: IC1.2 22.23,12.7 JP1.33
N$3
  Bottom 0.813: IC1.3 24.76,12.7 JP1.31
N$4
  Bottom 0.813: IC1.4 27.31,12.7 JP1.29
N$5
  Bottom 0.813: IC1.5 29.84,12.7 JP1.27
N$6
  Bottom 0.813: IC1.6 32.39,12.7 JP1.25
N$7
  Bottom 0.813: IC1.7 34.92,12.7 JP1.23
N$8
  Bottom 0.813: IC1.8 37.46,12.7 JP1.21
N$9
  Bottom 0.813: IC2.1 45.08,12.7 JP1.19
N$10
  Bottom 0.813: IC2.2 47.63,12.7 JP1.17
N$11
  Bottom 0.813: IC2.3 50.17,12.7 JP1.15
N$12
  Bottom 0.813: IC2.4 52.7,12.7 JP1.13
N$13
  Bottom 0.813: IC2.5 55.24,12.7 JP1.11
N$14
  Bottom 0.813: IC2.6 57.79,12.7 JP1.9
N$15
  Bottom 0.813: IC2.7 60.33,12.7 JP1.7
N$16
  Bottom 0.813: IC2.8 62.86,12.7 JP1.5
N$17
  Bottom 0.61: IC3.1 6.67,48.58 9.21,46.04 9.21,20.64 13.65,16.19 13.65,6.99 14.61,6.03 20.64,6.03 JP1.36
N$18
  Bottom 0.61: IC3.2 6.35,46.35 7.94,44.77 7.94,20.32 12.38,15.87 12.38,6.67 14.29,4.76 21.91,4.76 JP1.34
N$19
  Bottom 0.61: IC3.3 5.08,45.09 6.67,43.5 6.67,20 11.11,15.56 11.11,6.35 13.97,3.49 23.18,3.49 JP1.32
N$20
  Bottom 0.61: IC3.4 5.4,41.91 5.4,19.69 9.84,15.24 9.84,6.03 13.65,2.22 24.45,2.22 JP1.30
N$21
  Top 0.61: JP1.28 30.8,6.03 14.61,6.03 13.65,6.99 13.65,16.19 9.21,20.64 9.21,36.2 4.13,41.28 IC3.5
N$22
  Top 0.61: JP1.26 32.07,4.76 14.29,4.76 12.38,6.67 12.38,15.87 7.94,20.32 7.94,34.61 3.81,38.74 IC3.6
N$23
  Top 0.61: JP1.24 33.34,3.49 13.97,3.49 11.11,6.35 11.11,15.56 6.67,20 6.67,33.65 4.13,36.2 IC3.7
N$24
  Top 0.61: JP1.22 34.61,2.22 13.65,2.22 9.84,6.03 9.84,15.24 5.4,19.69 5.4,32.39 4.13,33.65 IC3.8
N$25
  Bottom 0.813: IC2.11 R17.1
N$26
  Bottom 0.813: IC2.12 R16.1
N$27
  Bottom 0.813: IC2.13 R15.1
N$28
  Bottom 0.813: IC2.14 R14.1
N$29
  Bottom 0.813: IC2.15 R13.1
N$30
  Bottom 0.813: IC2.16 R12.1
N$31
  Bottom 0.813: IC2.17 R11.1
N$32
  Bottom 0.813: IC2.18 R10.1
N$33
  Bottom 0.813: IC1.11 R8.1
N$34
  Bottom 0.813: IC1.12 R7.1
N$35
  Bottom 0.813: IC1.13 R6.1
N$36
  Bottom 0.813: IC1.14 R5.1
N$37
  Bottom 0.813: IC1.15 R4.1
N$38
  Bottom 0.813: IC1.16 R3.1
N$39
  Bottom 0.813: IC1.17 R2.1
N$40
  Bottom 0.813: IC1.18 R1.1
N$41
  Top 0.61: SG1.+ 7.42,14.81 8.57,13.65 8.57,5.71 13.34,0.95 35.88,0.95 JP1.20
N$42
  pour Top: 0,55.56 9.21,55.56 arc90 12.7,60.01 12.7,134.94 arc-85 17.14,140.02 66.04,140.02 arc-90 69.85,135.57 69.85,0 0,0
N$44
  pour Bottom: 0,0 70.8,0 70.8,141.29 0,141.29
VCC  (via drill 0.6)
  Wires 1.27: v6.67,11.11 v15.24,11.11
  Bottom 1.27: JP1.38 JP1.40 15.24,9.52 v15.24,11.11 15.24,14.6 17.14,16.51 17.46,16.51 | IC2.9 65.41,15.56 64.45,16.51 42.55,16.51 | 40.01,16.51 IC1.9 | 40.01,16.51 42.55,16.51 | 17.46,16.51 40.01,16.51 | 42.55,16.51 C2.1 | C1.1 17.14,16.83 17.46,16.51 | v6.67,11.11 6.67,4.76 4.8,3.22 3.85,3.18 X1.2
VERTICAL0
  Top 0.61: LED25.A 14.61,50.48 13.34,51.43 IC3.18
  Bottom 0.61: LED1.A 18.42,31.12 18.42,38.1 | 18.42,38.1 18.42,45.09 | 18.42,45.09 18.42,52.07 | 18.42,52.07 18.42,59.06 | 18.42,59.06 18.42,66.04 | 18.42,66.04 18.42,73.03 | 18.42,73.03 18.42,80.01 | 18.42,80.01 18.42,86.99 | 18.42,86.99 18.42,93.98 | 18.42,93.98 18.42,100.96 | 18.42,100.96 18.42,107.95 | 18.42,107.95 18.42,114.93 | 18.42,114.93 18.42,121.92 | 18.42,121.92 18.42,128.9 | 18.42,128.9 18.42,132.71 LED121.A | 18.42,38.1 LED9.A | 18.42,45.09 LED17.A | 18.42,52.07 LED25.A | 18.42,59.06 LED33.A | 18.42,66.04 LED41.A | 18.42,73.03 LED49.A | 18.42,80.01 LED57.A | 18.42,86.99 LED65.A | 18.42,93.98 LED73.A | 18.42,100.96 LED81.A | 18.42,107.95 LED89.A | 18.42,114.93 LED97.A | 18.42,121.92 LED105.A | 18.42,128.9 LED113.A
VERTICAL1
  Top 0.61: IC3.17 22.23,48.89 LED26.A
  Bottom 0.61: LED2.A 25.4,31.12 25.4,38.1 | 25.4,38.1 25.4,45.09 | 25.4,45.09 25.4,52.07 | 25.4,52.07 25.4,59.06 | 25.4,59.06 25.4,66.04 | 25.4,66.04 25.4,73.03 | 25.4,73.03 25.4,80.01 | 25.4,80.01 25.4,86.99 | 25.4,86.99 25.4,93.98 | 25.4,93.98 25.4,100.96 | 25.4,100.96 25.4,107.95 | 25.4,107.95 25.4,114.93 | 25.4,114.93 25.4,121.92 | 25.4,121.92 25.4,128.9 | 25.4,128.9 25.4,132.71 LED122.A | 25.4,38.1 LED10.A | 25.4,45.09 LED18.A | 25.4,52.07 LED26.A | 25.4,128.9 LED114.A | 25.4,121.92 LED106.A | 25.4,114.93 LED98.A | 25.4,107.95 LED90.A | 25.4,100.96 LED82.A | 25.4,93.98 LED74.A | 25.4,86.99 LED66.A | 25.4,80.01 LED58.A | 25.4,73.03 LED50.A | 25.4,66.04 LED42.A | 25.4,59.06 LED34.A
VERTICAL2
  Top 0.61: IC3.16 13.34,46.35 14.61,47.63 27.94,47.63 LED27.A
  Bottom 0.61: LED3.A 32.39,31.12 32.39,38.1 | 32.39,128.9 32.39,132.71 LED123.A | 32.39,128.9 32.39,121.92 | 32.39,121.92 32.39,114.93 | 32.39,114.93 32.39,107.95 | 32.39,107.95 32.39,100.96 | 32.39,100.96 32.39,93.98 | 32.39,93.98 32.39,86.99 | 32.39,86.99 32.39,80.01 | 32.39,80.01 32.39,73.03 | 32.39,73.03 32.39,66.04 | 32.39,66.04 32.39,59.06 | 32.39,59.06 32.39,52.07 | 32.39,52.07 32.39,45.09 | 32.39,45.09 32.39,38.1 | 32.39,38.1 LED11.A | 32.39,45.09 LED19.A | 32.39,52.07 LED27.A | 32.39,59.06 LED35.A | 32.39,66.04 LED43.A | 32.39,73.03 LED51.A | 32.39,80.01 LED59.A | 32.39,86.99 LED67.A | 32.39,93.98 LED75.A | 32.39,100.96 LED83.A | 32.39,107.95 LED91.A | 32.39,114.93 LED99.A | 32.39,121.92 LED107.A | 32.39,128.9 LED115.A
VERTICAL3
  Top 0.61: IC3.15 13.34,43.82 14.92,41.91 36.2,41.91 LED20.A
  Bottom 0.61: LED4.A 39.37,31.12 39.37,38.1 | 39.37,128.9 39.37,132.71 LED124.A | 39.37,128.9 39.37,121.92 | 39.37,121.92 39.37,114.93 | 39.37,114.93 39.37,107.95 | 39.37,107.95 39.37,100.96 | 39.37,100.96 39.37,93.98 | 39.37,93.98 39.37,86.99 | 39.37,86.99 39.37,80.01 | 39.37,80.01 39.37,73.03 | 39.37,73.03 39.37,66.04 | 39.37,66.04 39.37,59.06 | 39.37,59.06 39.37,52.07 | 39.37,52.07 39.37,45.09 | 39.37,45.09 39.37,38.1 | 39.37,38.1 LED12.A | 39.37,45.09 LED20.A | LED116.A 39.37,128.9 | 39.37,121.92 LED108.A | 39.37,114.93 LED100.A | 39.37,107.95 LED92.A | 39.37,100.96 LED84.A | 39.37,93.98 LED76.A | 39.37,86.99 LED68.A | 39.37,80.01 LED60.A | 39.37,73.03 LED52.A | 39.37,66.04 LED44.A | 39.37,59.06 LED36.A | 39.37,52.07 LED28.A
VERTICAL4
  Top 0.61: IC3.14 13.65,41.28 14.29,40.64 41.91,40.64 LED21.A
  Bottom 0.61: LED5.A 46.36,31.12 46.36,38.1 | 46.36,121.92 46.36,128.9 | 46.36,128.9 46.36,132.71 LED125.A | 46.36,121.92 46.36,114.93 | 46.36,114.93 46.36,107.95 | 46.36,107.95 46.36,100.96 | 46.36,100.96 46.36,93.98 | 46.36,93.98 46.36,86.99 | 46.36,86.99 46.36,80.01 | 46.36,80.01 46.36,73.03 | 46.36,73.03 46.36,66.04 | 46.36,66.04 46.36,59.06 | 46.36,59.06 46.36,52.07 | 46.36,52.07 46.36,45.09 | 46.36,45.09 46.36,38.1 | 46.36,114.93 LED101.A | LED109.A 46.36,121.92 | 46.36,128.9 LED117.A | 46.36,107.95 LED93.A | 46.36,100.96 LED85.A | 46.36,93.98 LED77.A | 46.36,86.99 LED69.A | 46.36,80.01 LED61.A | 46.36,73.03 LED53.A | 46.36,66.04 LED45.A | 46.36,59.06 LED37.A | 46.36,52.07 LED29.A | 46.36,45.09 LED21.A | 46.36,38.1 LED13.A
VERTICAL5
  Top 0.61: IC3.13 13.65,38.74 14.61,37.78 50.48,37.78 LED14.A
  Bottom 0.61: LED126.A 53.34,132.71 53.34,128.9 | 53.34,114.93 53.34,121.92 | 53.34,121.92 53.34,128.9 | 53.34,114.93 53.34,107.95 | 53.34,107.95 53.34,100.96 | 53.34,100.96 53.34,93.98 | 53.34,93.98 53.34,86.99 | 53.34,86.99 53.34,80.01 | 53.34,80.01 53.34,73.03 | 53.34,73.03 53.34,66.04 | 53.34,66.04 53.34,59.06 | 53.34,59.06 53.34,52.07 | 53.34,52.07 53.34,45.09 | 53.34,45.09 53.34,38.1 | 53.34,38.1 53.34,31.12 LED6.A | 53.34,38.1 LED14.A | 53.34,45.09 LED22.A | 53.34,52.07 LED30.A | 53.34,59.06 LED38.A | 53.34,66.04 LED46.A | 53.34,73.03 LED54.A | 53.34,80.01 LED62.A | 53.34,86.99 LED70.A | 53.34,93.98 LED78.A | 53.34,100.96 LED86.A | 53.34,107.95 LED94.A | LED102.A 53.34,114.93 | 53.34,121.92 LED110.A | 53.34,128.9 LED118.A
VERTICAL6
  Top 0.61: IC3.12 13.65,36.2 14.92,34.92 57.15,34.92 LED15.A
  Bottom 0.61: LED7.A 60.33,31.12 60.33,38.1 | 60.33,128.9 60.33,132.71 LED127.A | 60.33,121.92 60.33,128.9 | 60.33,114.93 60.33,121.92 | 60.33,107.95 60.33,114.93 | 60.33,107.95 60.33,100.96 | 60.33,100.96 60.33,93.98 | 60.33,93.98 60.33,86.99 | 60.33,86.99 60.33,80.01 | 60.33,80.01 60.33,73.03 | 60.33,73.03 60.33,66.04 | 60.33,66.04 60.33,59.06 | 60.33,59.06 60.33,52.07 | 60.33,52.07 60.33,45.09 | 60.33,45.09 60.33,38.1 | 60.33,38.1 LED15.A | 60.33,45.09 LED23.A | 60.33,128.9 LED119.A | 60.33,121.92 LED111.A | 60.33,114.93 LED103.A | LED95.A 60.33,107.95 | 60.33,100.96 LED87.A | 60.33,93.98 LED79.A | 60.33,86.99 LED71.A | 60.33,80.01 LED63.A | 60.33,73.03 LED55.A | 60.33,66.04 LED47.A | 60.33,59.06 LED39.A | 60.33,52.07 LED31.A
VERTICAL7
  Top 0.61: IC3.11 62.86,33.65 LED16.A
  Bottom 0.61: LED128.A 67.31,132.71 67.31,128.9 | 67.31,100.96 67.31,107.95 | 67.31,107.95 67.31,114.93 | 67.31,114.93 67.31,121.92 | 67.31,121.92 67.31,128.9 | 67.31,100.96 67.31,93.98 | 67.31,93.98 67.31,86.99 | 67.31,86.99 67.31,80.01 | 67.31,80.01 67.31,73.03 | 67.31,73.03 67.31,66.04 | 67.31,66.04 67.31,59.06 | 67.31,59.06 67.31,52.07 | 67.31,52.07 67.31,45.09 | 67.31,45.09 67.31,38.1 | 67.31,38.1 67.31,31.12 LED8.A | 67.31,38.1 LED16.A | 67.31,45.09 LED24.A | 67.31,52.07 LED32.A | 67.31,59.06 LED40.A | 67.31,66.04 LED48.A | 67.31,73.03 LED56.A | 67.31,80.01 LED64.A | 67.31,86.99 LED72.A | 67.31,93.98 LED80.A | LED88.A 67.31,100.96 | 67.31,107.95 LED96.A | 67.31,114.93 LED104.A | 67.31,121.92 LED112.A | 67.31,128.9 LED120.A
(copper drawn outside any net)
  shapes: Top area x1305

### Text on the board
Top: uC-Tetris v2 | /home/stv0g/Desktop/rwth.bmp
Bottom: + -